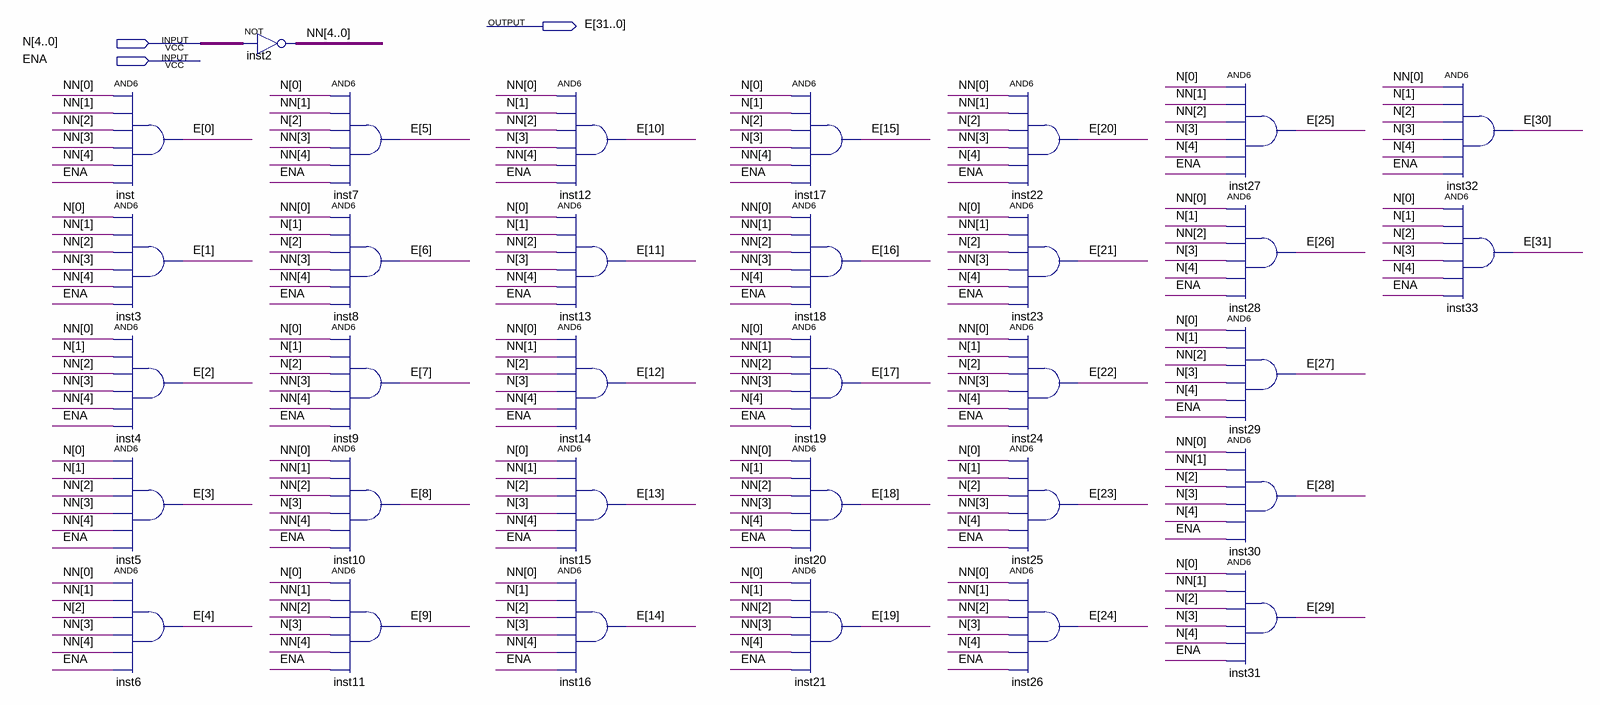
[diagram p0: schematic sheet]
// Quartus schematic dec5e.bdf as structural Verilog: 33 symbols, 3 pins
module dec5e (
  input  [4:0] N,
  input  ENA,
  output [31:0] E
);

  wire [4:0] NN;

  and inst (E[0], NN[0], NN[1], NN[2], NN[3], NN[4], ENA);
  and inst3 (E[1], N[0], NN[1], NN[2], NN[3], NN[4], ENA);
  and inst4 (E[2], NN[0], N[1], NN[2], NN[3], NN[4], ENA);
  and inst5 (E[3], N[0], N[1], NN[2], NN[3], NN[4], ENA);
  and inst6 (E[4], NN[0], NN[1], N[2], NN[3], NN[4], ENA);
  assign NN = ~N;  // NOT inst2, 5 bits wide
  and inst7 (E[5], N[0], NN[1], N[2], NN[3], NN[4], ENA);
  and inst8 (E[6], NN[0], N[1], N[2], NN[3], NN[4], ENA);
  and inst9 (E[7], N[0], N[1], N[2], NN[3], NN[4], ENA);
  and inst10 (E[8], NN[0], NN[1], NN[2], N[3], NN[4], ENA);
  and inst11 (E[9], N[0], NN[1], NN[2], N[3], NN[4], ENA);
  and inst12 (E[10], NN[0], N[1], NN[2], N[3], NN[4], ENA);
  and inst13 (E[11], N[0], N[1], NN[2], N[3], NN[4], ENA);
  and inst14 (E[12], NN[0], NN[1], N[2], N[3], NN[4], ENA);
  and inst15 (E[13], N[0], NN[1], N[2], N[3], NN[4], ENA);
  and inst16 (E[14], NN[0], N[1], N[2], N[3], NN[4], ENA);
  and inst17 (E[15], N[0], N[1], N[2], N[3], NN[4], ENA);
  and inst18 (E[16], NN[0], NN[1], NN[2], NN[3], N[4], ENA);
  and inst19 (E[17], N[0], NN[1], NN[2], NN[3], N[4], ENA);
  and inst20 (E[18], NN[0], N[1], NN[2], NN[3], N[4], ENA);
  and inst21 (E[19], N[0], N[1], NN[2], NN[3], N[4], ENA);
  and inst22 (E[20], NN[0], NN[1], N[2], NN[3], N[4], ENA);
  and inst23 (E[21], N[0], NN[1], N[2], NN[3], N[4], ENA);
  and inst24 (E[22], NN[0], N[1], N[2], NN[3], N[4], ENA);
  and inst25 (E[23], N[0], N[1], N[2], NN[3], N[4], ENA);
  and inst26 (E[24], NN[0], NN[1], NN[2], N[3], N[4], ENA);
  and inst27 (E[25], N[0], NN[1], NN[2], N[3], N[4], ENA);
  and inst28 (E[26], NN[0], N[1], NN[2], N[3], N[4], ENA);
  and inst29 (E[27], N[0], N[1], NN[2], N[3], N[4], ENA);
  and inst30 (E[28], NN[0], NN[1], N[2], N[3], N[4], ENA);
  and inst31 (E[29], N[0], NN[1], N[2], N[3], N[4], ENA);
  and inst32 (E[30], NN[0], N[1], N[2], N[3], N[4], ENA);
  and inst33 (E[31], N[0], N[1], N[2], N[3], N[4], ENA);
endmodule
